# Altium schematic sheet Doorbellv1.1.SchDoc
size A4; SheetNumber: 1; SheetTotal: 3
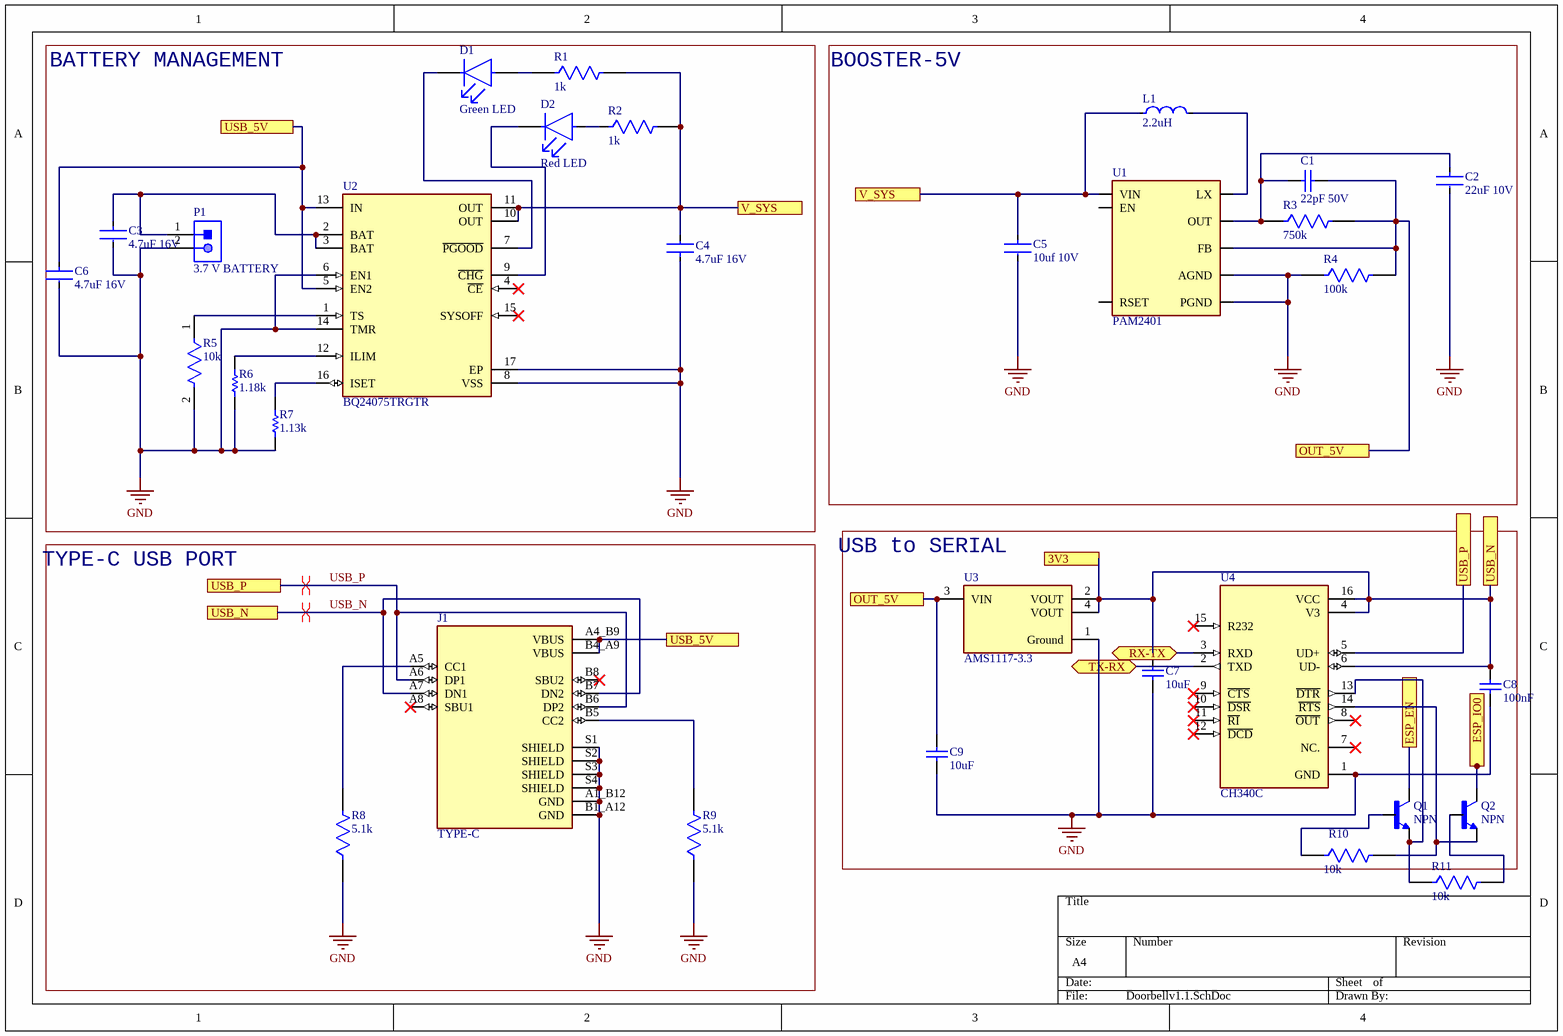
[diagram p0: Doorbellv1.1.SchDoc]

## Parts
C1  22pF 50V  [CAPC0805(2012)145_N]
C2  22uF 10V  [FP-C0805C226M8PACTU-MFG]
C3  4.7uF 16V  [FP-GRM21B-0_15-MFG]
C4  4.7uF 16V  [FP-GRM21B-0_15-MFG]
C5  10uf 10V  [FP-C0805X106K8RACAUTO-MFG]
C6  4.7uF 16V  [FP-GRM21B-0_15-MFG]
C7  10uF  [CAPC2013X140X50ML20T25]
C8  100nF  [CAPC1608X90X35NL15T15]
C9  10uF  [CAPC2013X140X50ML20T25]
D1  Green LED  [FP-APHCM2012CGCK-F01-MFG]
D2  Red LED  [FP-LS_R976-MFG]
J1  TYPE-C  [HRO_TYPE-C-31-M-12]
L1  2.2uH  [FP-NR4018-MFG]
P1  3.7 V BATTERY  [JST-S2B-PH-K-S_V]
Q1  NPN  [TRANS_SS8050-G]
Q2  NPN  [TRANS_SS8050-G]
R1  1k  [FP-TFCR0805-IPC_A]
R2  1k  [FP-TFCR0805-IPC_A]
R3  750k  [FP-AC0805-MFG]
R4  100k  [FP-CRCW0805-e3-IPC_A]
R5  10k  [FP-RN732B-MFG]
R6  1.18k  [RESC2013X60X35LL10T20]
R7  1.13k  [RESC0805(2012)_L]
R8  5.1k  [FP-CRCW0603-C-MFG]
R9  5.1k  [FP-CRCW0603-C-MFG]
R10  10k  [FP-CPF0603-MFG]
R11  10k  [FP-CPF0603-MFG]
U1  PAM2401  [MSOP8]
U2  BQ24075TRGTR  [FP-RGT0016C-IPC_C]
U3  AMS1117-3.3  [FP-AMS1117-IPC_C]
U4  CH340C  [SOIC127P600X180-16N]

## Blocks framed on the sheet
BATTERY MANAGEMENT: C3 C4 C6 D1 D2 P1 R1 R2 R5-R7 U2
BOOSTER-5V: C1 C2 C5 L1 R3 R4 U1
TYPE-C USB PORT: J1 R8 R9
USB to SERIAL: C7-C9 Q1 Q2 R10 U3 U4

## Ports
3V3 (see Doorbellv1.2[2A], Doorbellv1.3[1A]), ESP_EN (see Doorbellv1.2[1B]), ESP_IO0 (see Doorbellv1.2[1B]), OUT_5V (see Doorbellv1.1[3C], Doorbellv1.2[4B], Doorbellv1.3[1C], Doorbellv1.3[3B], Doorbellv1.3[4A]), OUT_5V (see Doorbellv1.1[4B], Doorbellv1.2[4B], Doorbellv1.3[1C], Doorbellv1.3[3B], Doorbellv1.3[4A]), RX-TX (bidir, see Doorbellv1.2[2B]), TX-RX (bidir, see Doorbellv1.2[2B]), USB_5V (see Doorbellv1.1[1A]), USB_5V (see Doorbellv1.1[2C]), USB_N (see Doorbellv1.1[1C]), USB_N (see Doorbellv1.1[4C]), USB_P (see Doorbellv1.1[1C]), USB_P (see Doorbellv1.1[4C]), V_SYS (see Doorbellv1.1[2A]), V_SYS (see Doorbellv1.1[3A])

## Nets
GND: C2.2 C3.2 C4.1 C5.2 C6.2 C7.1 C8.1 C9.1 J1.A1_B12(GND) J1.B1_A12(GND) J1.S1(SHIELD) J1.S2(SHIELD) J1.S3(SHIELD) J1.S4(SHIELD) P1.2 R4.1 R5.2 R6.1 R7.1 R8.1 R9.1 U1.4(AGND) U1.8(PGND) U2.6(EN1) U2.8(VSS) U2.14(TMR) U2.17(EP) U3.1(Ground) U4.1(GND)
ESP_EN: Q1.3(C) ; port ESP_EN
ESP_IO0: Q2.3(C) ; port ESP_IO0
OUT_5V: C1.2 C9.2 R3.2 R4.2 U1.5(FB) U3.3(VIN) ; port OUT_5V
RX-TX: U4.3(RXD) ; port RX-TX
TX-RX: U4.2(TXD) ; port TX-RX
USB_5V: C6.1 J1.A4_B9(VBUS) J1.B4_A9(VBUS) U2.5(EN2) U2.13(IN) ; port USB_5V
USB_N: C7.2 C8.2 J1.A7(DN1) J1.B7(DN2) U3.2(VOUT) U3.4(VOUT) U4.4(V3) U4.6(UD-) U4.16(VCC) ; port USB_N, port 3V3
USB_P: J1.A6(DP1) J1.B6(DP2) U4.5(UD+) ; port USB_P
V_SYS: C4.2 C5.1 L1.1 R1.2 R2.2 U1.3(VIN) U2.10(OUT) U2.11(OUT) ; port V_SYS
NetC1_1: C1.1 C2.1 R3.1 U1.7(OUT)
NetC3_1: C3.1 P1.1 U2.2(BAT) U2.3(BAT)
NetD1_1: D1.1(C) U2.7(~{PGOOD})
NetD1_2: D1.2(A) R1.1
NetD2_1: D2.1(C) U2.9(~{CHG})
NetD2_2: D2.2(A) R2.1
NetJ1_A5: J1.A5(CC1) R8.2
NetJ1_B5: J1.B5(CC2) R9.2
NetL1_2: L1.2 U1.1(LX)
NetQ1_1: Q1.1(B) R10.1
NetQ1_2: Q1.2(E) R11.1 U4.13(~{DTR})
NetQ2_1: Q2.1(B) R11.2
NetQ2_2: Q2.2(E) R10.2 U4.14(~{RTS})
NetR5_1: R5.1 U2.1(TS)
NetR6_2: R6.2 U2.12(ILIM)
NetR7_2: R7.2 U2.16(ISET)

Not connected (* = marked no-connect by the designer): J1 A8(SBU1)* B8(SBU2)*; U1 2(EN) 6(RSET); U2 4(~{CE})* 15(SYSOFF)*; U4 7(NC.)* 8(~{OUT})* 9(~{CTS})* 10(~{DSR})* 11(~{RI})* 12(~{DCD})* 15(R232)*

## Layout directives
differential pair: USB_N, USB_P

## Library data of the parts
C1 = CMP-1036-01235-1: CAP 22pF 50V ±1% 0805 (2012 Metric) Thickness 1.45mm SMD; Tolerance: Â±1%; Case-Metric: 2012; Case-EIA: 0805; Max Thickness: 1.45 mm; Rated Voltage: 50 V; Value: 22pF; Technology: SMT
C2 = CMP-03020-034697-1: CAP CER 22UF 10V X5R 0805; Tolerance: 20%; Dissipation Factor: 10%; Dielectric Material: Ceramic; Termination: Solder; Case Code (Imperial): 0805; Packaging: Tape and Reel; Height: 1.25mm; Voltage: 10V; Case Code (Metric): 2012; Case/Package: 0805; Width: 0.049inch; Capacitance: 22uF; Length: 0.079inch; Depth: 1.25mm; RoHS Compliant: Yes; Voltage Rating (DC): 10V; Lead Free: Lead Free; Dielectric: X5R; Thickness: 0.055inch; Mount: Surface Mount; Voltage Rating: 10V; Max Operating Temperature: 85°C; Min Operating Temperature: -55°C
C3 C4 C6 = CMP-06035-032042-1: Chip Multilayer Ceramic Capacitors for General Purpose, 0805, 4.7uF, X7R, 15%, 20%, 16V; Tolerance: 20%; Capacitance: 4.7uF; Case/Package: 0805; Thickness: 1.25mm; Length: 2mm; Width: 1.25mm; Dielectric: X7R; Voltage Rating (DC): 16V
C5 = CMP-03020-034694-1: Tolerance: 10%; Case/Package: 0805; Min Operating Temperature: -55°C; Max Operating Temperature: 125°C; RoHS Compliant: Yes; Ratings: AEC-Q200; Mount: Surface Mount; Features: Soft Termination; Capacitance: 10uF; Packaging: Cut Tape; Case Code (Metric): 2012; Voltage Rating: 10V; Case Code (Imperial): 0805
C7 C9 = CMP-2007-04644-1: Part Number: 08056D106KAT4A; Manufacturer: AVX Interconnect / Elco
C8 = CMP-2006-04392-1: Manufacturer: AVX Interconnect / Elco; Part Number: 06035C104MAT2A
D1 = CMP-44529-000062-1: LED GREEN CLEAR CHIP SMD; Dominant Wavelength: 570nm; Forward Current: 20mA; Number of LEDs: 1; Luminous Intensity: 40mcd; Forward Voltage: 2.1V; Viewing Angle: 110°; Illumination Color: Green; Lens Style: Clear; Mount: Surface Mount; Length: 2mm; Max Operating Temperature: 85°C; Series: APHCM; Width: 1.25mm; Lead Free: Lead Free; Wavelength: 570nm; Package Quantity: 1; Number of Pins: 2; Case Code (Metric): 2012; RoHS Compliant: Yes; Packaging: Tape and Reel; Lens Color: Clear; Case/Package: 0805; Case Code (Imperial): 0805; Test Current: 20mA; Color: Green; Min Operating Temperature: -40°C; Height: 0.4mm
D2 = CMP-62016-000037-1: LED RED DIFFUSED 0805 SMD; Lens Size: 1.25mm; Number of LEDs: 1; Luminous Intensity: 180mcd; Dominant Wavelength: 633nm; Lens Style: Flat; Reverse Voltage: 12V; Lens Color: White; Forward Voltage: 2.5V; Forward Current: 25mA; Power Dissipation: 65W; Luminous Flux: 0.47lm; Test Current: 20mA; Viewing Angle: 160°; Length: 2mm; Number of Pins: 2; Lens Transparency: Diffused; Min Operating Temperature: -30°C; Case Code (Metric): 2012; Depth: 1.35mm; Color: Red; Illumination Color: Red; Max Operating Temperature: 85°C; Mount: Surface Mount; Case/Package: 0805; Height: 0.9mm; Package Quantity: 16000; Number of Elements: 1; Radiation Hardening: No; Case Code (Imperial): 0805; Packaging: Tape and Reel; Width: 1.25mm
J1 = TYPE-C-31-M-12: USB Connectors 24 Receptacle 1 8.94*7.3mm RoHS; MF: HRO Electronics Co., Ltd.; SnapEDA_Link: https://www.snapeda.com/parts/TYPE-C-31-M-12/HRO+Electronics+Co.%252C+Ltd./view-part/?ref=snap; Package: Package; Value: *; MP: TYPE-C-31-M-12; Check_prices: https://www.snapeda.com/parts/TYPE-C-31-M-12/HRO+Electronics+Co.%252C+Ltd./view-part/?ref=eda
L1 = CMP-14484-000071-2: SMD Power Inductors 2.2uH ±20% 2.2A 50.4mΩ; Test Frequency: 100kHz; Shielding: Shielded; Core Material: Ferrite; Saturation Current: 3A; Self Resonant Frequency: 60MHz; DC Resistance (DCR): 50.4mR; Height - Seated (Max): 0.071inch; RMS Current (Irms): 2.2A; Min Operating Temperature: -25°C; RoHS Compliant: Yes; Max Operating Temperature: 125°C; Package Quantity: 3500; Halogen Free: Halogen Free; Number of Pins: 2; Packaging: Tape and Reel; Inductance Tolerance: 20%; Lead Pitch: 2.8mm; Width: 0.157inch; Max DC Current: 3A; Tolerance: 20%; Length: 4mm; Resistor Type: Wirewound; Depth: 4.2mm; Current Rating: 2.2A; Lead Free: Lead Free; Series: NRS; Termination: SMD/SMT; Radiation Hardening: No; Mount: Surface Mount; Height: 1.8mm; Inductance: 2.2uH; Case/Package: Nonstandard
P1 = CMP-1755-00004-1: Male Header, Pitch 2 mm, 1 x 2 Position, Height 4.8 mm, Tail Length 3.4 mm, -25 to 85 degC, RoHS, Bulk; Case\Package: Radial; Tolerance: 20%; Capacitance: 10 uF; Voltage Rating (DC): 50 V; Packaging: Bulk; ComponentLink1URL: http://www.jst-mfg.com/product/pdf/eng/ePH.pdf; Radiation Hardening: No; Height: 11 mm; Package Quantity: 200; PackageDescription: Male Header, Pitch 2 mm, 1 x 2 Position, Height 4.8 mm, Tail Length 3.4 mm; PackageReference: S2B-PH-K-S; Diameter: 5 mm; Pins: 2; Mount: Through Hole; Max Operating Temperature: 85 degC; Min Operating Temperature: -40 degC; ComponentLink1Description: Datasheet; DatasheetVersion: Dec-12; Length: 11 mm; Lead Pitch: 2 mm; REACH SVHC: No SVHC; Voltage Rating: 50 V; RoHSCompliant: true
Q1 Q2 = SS8050-G: Bipolar (BJT) Transistor NPN 25 V 1.5 A 100MHz 300 mW Surface Mount SOT-23-3; MP: SS8050G; MF: Comchip; Digi-Key_Part_Number: 641-1790-2-ND; Check_prices: https://www.snapeda.com/parts/SS8050G/Comchip/view-part/?ref=eda; Package: None; SnapEDA_Link: https://www.snapeda.com/parts/SS8050G/Comchip/view-part/?ref=snap; Value: *
R1 R2 = CMP-250906-148809-1: RES Thin Film,  1kΩ, 0.1%, 0.1W, 25ppm/°C, 0805
R3 = CMP-03412-037118-1: AC Series 0805 750 kO ±1% 0.125 W ±100 ppm/°C SMT Thick Film Chip Resistor; Manufacturer: Yageo; Manufacturer Part Number: AC0805FR-07750KL; Resistance: 750KΩ; Power Rating: 1/8W; Automotive Grade: Grade 0; Value: 750KΩ; Tolerance: 0.01; Voltage Rating: 150V; Device Class L1: Passive Components; Ipc Land Pattern Name: RESC200125X50; Temperature: -55°C to +155°C; Device Class L2: Resistors; RoHS: TRUE; Composition: Thick Film; Device Class L3: Chip SMD Resistors; ComponentLink2URL: http://www.yageo.com/documents/recent/PYu-AC_51_RoHS_L_6.pdf; Footprint Url: http://www.yageo.com/exep/pages/download/literatures/PYu-R_Mount_10.pdf; Temperature Range High: +155°C; Automotive: Yes; Digikey Description: AC Series 0805 750 kO ±1% 0.125 W ±100 ppm/°C SMT Thick Film Chip Resistor; ComponentLink2Description: Datasheet; Package: AC0805; Temperature Range Low: -55°C; Lead Free: Yes; Octopart: https://octopart.com/ac0805fr-07750kl-yageo-26041180; Category: Res; Height: 0.6mm; Series: AC
R4 = CMP-02407-006346-1: RES Thick Film, 100kΩ, 1%, 0.125W, 100ppm/°C, 0805; Resistance: 100kR; Max Power Dissipation: 125mW; Max Operating Temperature: 155°C; Lead Free: Lead Free; Temperature Coefficient: 100ppm/°C; Radiation Hardening: No; Military Standard: Not; Height: 0.02inch; Contact Plating: Tin; Length: 0.079inch; Tolerance: 1%; Composition: Thick Film; Case/Package: 0805; Package Quantity: 20000; Width: 0.049inch; Depth: 1.25mm; Features: Automotive AEC-Q200; Number of Terminations: 2; Packaging: Tape and Reel; Min Operating Temperature: -55°C
R5 = CMP-04015-036251-1: 10kΩ ±0.1% 0.125W, 1/8W Chip Resistor 1206 (3216 Metric) Moisture Resistant Thin Film; Voltage Rating: 150V; Power Rating: 125mW; Temperature Coefficient: 10ppm/°C; Resistance: 10kR; Case Code (Imperial): 1206; Weight: 0.000571oz; Composition: Thin Film; Max Operating Temperature: 125°C; Width: 1.6mm; Termination: SMD/SMT; Case/Package: 1206; Voltage Rating (DC): 150V; Tolerance: 0.1%; Min Operating Temperature: -55°C; Packaging: Tape and Reel; Case Code (Metric): 3216; Length: 3.2mm; Height: 0.6mm
R6 = CMP-2001-00901-1: Manufacturer: Yageo; Part Number: RC0805FR-07118KL
R7 = CMP-1013-00515-1: 1K13 0.125W 1% 0805 (2012 Metric)  SMD; Value: 1130.00 Ohm; Case-Metric: 2012; Case-EIA: 0805; Tolerance: 1 %; Technology: SMT; Power: 0.125 W
R8 R9 = CMP-02407-012725-1: RES 5.1K OHM 1% 1/10W 0603; Max Power Dissipation: 100mW; Resistance: 5.1kR; Temperature Coefficient: 100ppm/°C; Min Operating Temperature: -55°C; Packaging: Tape and Reel; Max Operating Temperature: 155°C; RoHS Compliant: Yes; Series: CRCW-C; Case/Package: 0603; Number of Terminations: 2; Tolerance: 1%; Resistor Type: Thick Film
R10 R11 = CMP-03211-003506-1: RES SMD 10KΩ 0.5% 1/16W 0603; Manufacturer: TE Connectivity; Manufacturer Part Number: CPF0603D10KE; Power Rating: 0.063W; Temperature Coefficient: 25ppm/°C; Voltage Rating: 50V; ComponentLink2Description: Datasheet; packaging: 5k Reel; Automotive: No; Octopart: https://octopart.com/cpf0603d10ke-te+connectivity-22737789; Composition: Thin Film; Value: 10KΩ; Category: Res; RoHS: TRUE; Height: 0.55mm; Lead Free: Yes; ComponentLink2URL: https://www.te.com/commerce/DocumentDelivery/DDEController?Action=showdoc&DocId=Data+Sheet%7F1773200%7FM%7Fpdf%7FEnglish%7FENG_DS_1773200_M.pdf%7F3-1676481-2; Temperature: -55°C to +155°C; Device Class L3: Chip SMD Resistors; Device Class L1: Passive Components; octopart_url: https://octopart.com/cpf0603d10ke-te+connectivity-22737789; Tolerance: 0.5%; Resistance: 10KΩ; Package: CPF0603; Temperature Range High: +155°C; Series: CPF; Temperature Range Low: -55°C; Device Class L2: Resistors; Ipc Land Pattern Name: RESC15580X45
U1 = PAM2401: Conv DC-DC 0.9V to 4.75V Synchronous Step Up Single-Out 2.5V to 5V 12-Pin UDFN EP T/R; MF: Diodes Zetex; SnapEDA_Link: https://www.snapeda.com/parts/PAM2401/Zetex/view-part/?ref=snap; Package: None; Value: *; MP: PAM2401; Check_prices: https://www.snapeda.com/parts/PAM2401/Zetex/view-part/?ref=eda
U2 = CMP-0321-00266-3: IC LI-ION CHARGE/PWR MGMT 16QFN; Min Supply Voltage: 4.35V; Max Power Dissipation: 2.3W; Min Input Voltage: 4.3V; Output Current: 1.5A; Number of Cells: 1; Operating Supply Current: 1.5mA; Output Voltage: 4.2V; Max Supply Voltage: 6.4V; RoHS Compliant: Yes; Case/Package: VQFN EP; Contact Plating: Gold; Min Operating Temperature: -40°C; Lead Free: Lead Free; Series: -; Number of Pins: 16; Radiation Hardening: No; Package Quantity: 1; Max Operating Temperature: 85°C; Packaging: Tape and Reel
U3 = CMP-209535-000001-1: LDO Voltage Regulators 1A, 3.3V; Manufacturer: Advanced Monolithic Systems; Dropout Voltage: 1.1V; Output Type: Fixed; Nominal Supply Current: 5mA; Max Power Dissipation: 1.2W; Max Supply Voltage: 15V; Number Of Outputs: 1; Standoff Height: 0.64mm; Max Junction Temp: +125°C; Height: 1.8mm; Package: AMS1117; Device Class L2: Power Management ICs; ComponentLink2Description: Datasheet; ComponentLink2URL: http://www.advanced-monolithic.com/pdf/ds1117.pdf; Category: IC; RoHS: TRUE; Automotive: No; Device Class L1: Integrated Circuits (ICs); Output Current: 1A; Device Class L3: Voltage Regulators - Linear; Temperature: -40°C to +125°C; Output Voltage: 3.3V; Manufacturer Part Number: AMS1117-3.3; Temperature Range Low: -40°C; Octopart: https://octopart.com/ams1117-3.3-advanced+monolithic+systems-25899300; Lead Free: Yes; Ipc Land Pattern Name: SOT229P700X180-4; Temperature Range High: +125°C
U4 = CH340C: USB to serial chip CH340; MF: WCH; Price: None; Availability: Not in stock; MP: CH340C; Package: None; SnapEDA_Link: https://www.snapeda.com/parts/CH340C/WCH/view-part/?ref=snap; Check_prices: https://www.snapeda.com/parts/CH340C/WCH/view-part/?ref=eda; Value: *